# EAGLE design Adafruit HTU21DF Breakout (EAGLE 6.6.0)
COMPANY: ADAFRUIT INDUSTRIES; DRAWN: KTOWN; REV: A
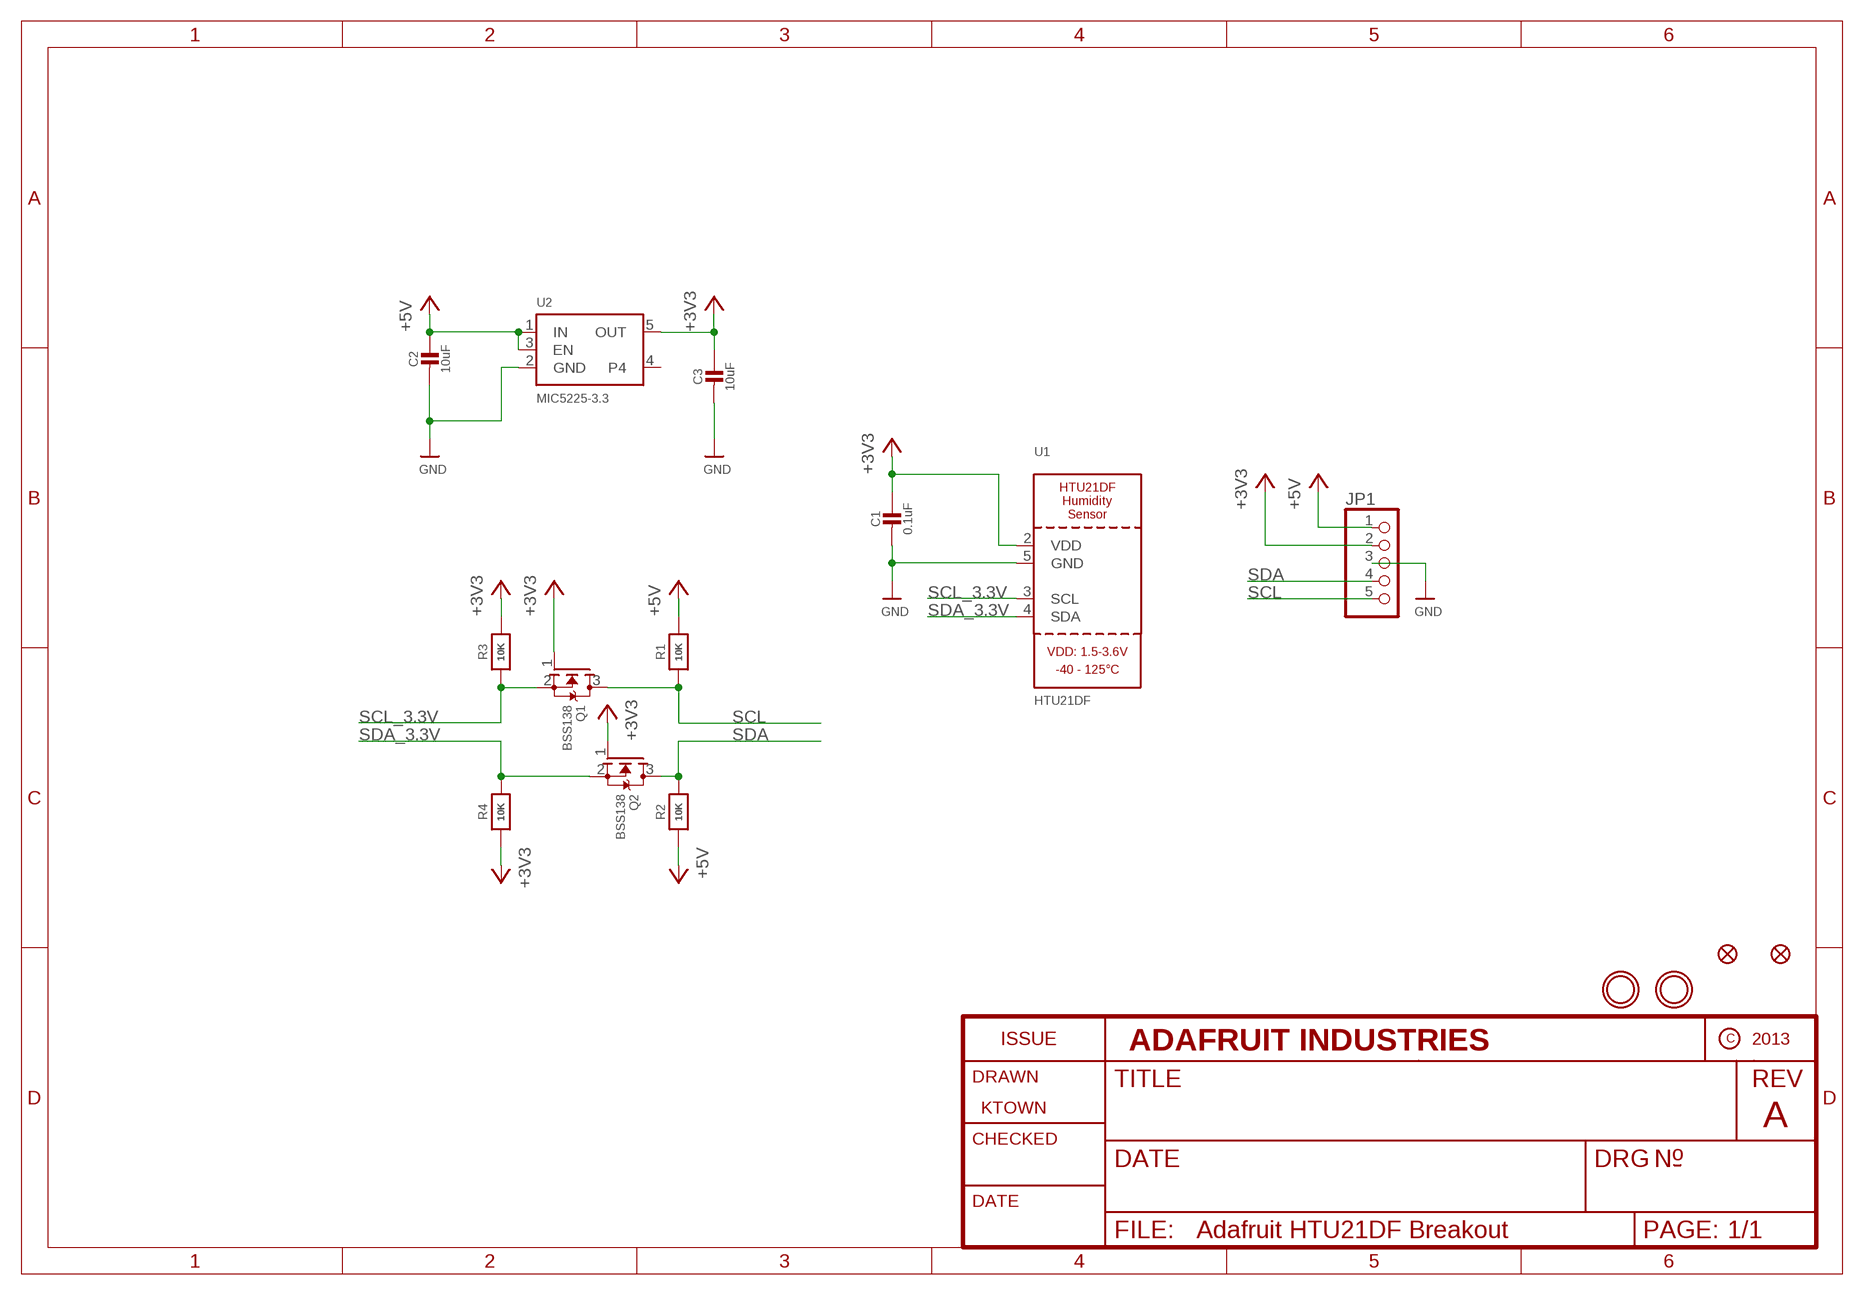
[diagram p0: schematic, sheet 1]

## Parts
C1  0.1uF  CAP_CERAMIC0805-NOOUTLINE  [0805-NO]
C2  10uF  CAP_CERAMIC0805-NOOUTLINE  [0805-NO]
C3  10uF  CAP_CERAMIC0805-NOOUTLINE  [0805-NO]
FID1  FIDUCIAL""  [FIDUCIAL_1MM]
FID2  FIDUCIAL""  [FIDUCIAL_1MM]
JP1  HEADER-1X570MIL  [1X05_ROUND_70]
Q1  BSS138  MOSFET-NWIDE  [SOT23-WIDE]
Q2  BSS138  MOSFET-NWIDE  [SOT23-WIDE]
R1  10K  RESISTOR0805_NOOUTLINE  [0805-NO]
R2  10K  RESISTOR0805_NOOUTLINE  [0805-NO]
R3  10K  RESISTOR0805_NOOUTLINE  [0805-NO]
R4  10K  RESISTOR0805_NOOUTLINE  [0805-NO]
U1  HTU21DF  [HTU21DF]
U2  MIC5225-3.3  VREG_SOT23-5  [SOT23-5]
U$3  MOUNTINGHOLE2.5  [MOUNTINGHOLE_2.5_PLATED]
U$4  MOUNTINGHOLE2.5  [MOUNTINGHOLE_2.5_PLATED]

## Nets
+3V3: C1.1 C3.1 JP1.2 Q1.1(G) Q2.1(G) R3.2 R4.1 U1.2(VDD) U2.5(OUT)
GND: C1.2 C2.2 C3.2 JP1.3 U1.5(GND) U2.2(GND)
SCL: JP1.5 Q1.3(D) R1.1
SCL_3.3V: Q1.2(S) R3.1 U1.3(SCL)
SDA: JP1.4 Q2.3(D) R2.2
SDA_3.3V: Q2.2(S) R4.2 U1.4(SDA)
VIN: C2.1 JP1.1 R1.2 R2.1 U2.1(IN) U2.3(EN) ; supply symbol labelled +5V
Unconnected: U2.4

## Library data of the parts
C1-C3 = microbuilder:CAP_CERAMIC: Ceramic Capacitors For new designs, use the packages preceded by an '_' character since they are more reliable: The following footprints should be used on most boards: _0402 - Standard footprint for regular board layouts _0603 - Standard footprint for regular board layouts _0805 - Standard footprint for regular board layouts _1206 - Standard footprint for regular board layouts For extremely tight-pitch boards where space is at a premium, the following 'micro-pitch' footprints can be used (smaller pads, no silkscreen outline, etc.): _0402MP - Micro-pitch footprint for very dense/compact boards _0603MP - Micro-pitch footprint for very dense/compact boards _0805MP - Micro-pitch footprint for very dense/compact boards _1206MP - Micro-pitch footprint for very dense/compact boards
FID1 FID2 = microbuilder:FIDUCIAL: Fiducial Alignment Points Various fiducial points for machine vision alignment.; BOM: EXCLUDE
JP1 = microbuilder:HEADER-1X5: PIN HEADER
Q1 Q2 = microbuilder:MOSFET-N: N-Channel Mosfet LEGEND VDS: Voltage Drain-Source ID: Drain Current RDS(ON): Drain-Source On-State Resistance VGS(TH): Gate-Source Threshold Voltage CISS: Drain-Source Input Capacitance SOT-23 Name VDS ID RDS(ON) VGS(TH) CISS Order Number 2N7002E 60V 260mA 2.5 Ohm 2.5V @ 250uA 26.7pF @ 25V 2N7002ET1GOSTR-ND BSH103 30V 850mA 400 mOhm 400mV @ 1mA 83pF @ 24V BSH103,235-ND BSS138 60V 320mA 1.6 Ohm 1.5V @ 250uA 50pF @ 10V Mouser: 771-BSS138PW115 DMN2075U-7 20V 4.2A 38 mOhm 1V @ 250 uA 594.3pF @ 10V DMN2075U-7DICT-ND * BSS138 good choice for I2C level-shifting POWERPAK 1212-8 Name VDS ID RDS(ON) VGS(TH) CISS Order Number Si7308DN 60V 6A 58 mOhm 3V @ 250uA 665pF @ 15V SI7308DN-T1-E3CT-ND
R1-R4 = microbuilder:RESISTOR: Resistors For new designs, use the packages preceded by an '_' character since they are more reliable: The following footprints should be used on most boards: _0402 - Standard footprint for regular board layouts _0603 - Standard footprint for regular board layouts _0805 - Standard footprint for regular board layouts _1206 - Standard footprint for regular board layouts For extremely tight-pitch boards where space is at a premium, the following 'micro-pitch' footprints can be used (smaller pads, no silkscreen outline, etc.): _0402MP - Micro-pitch footprint for very dense/compact boards _0603MP - Micro-pitch footprint for very dense/compact boards _0805MP - Micro-pitch footprint for very dense/compact boards _1206MP - Micro-pitch footprint for very dense/compact boards
U1 = microbuilder:HTU21DF: HTU21DF - Relative Humidity and Temperature Sensor
U2 = microbuilder:VREG_SOT23-5: SOT23-5 Fixed Voltage Regulators Part Current Out V Out V In V Dropout θJA (°C/W) TJ (°C) Digikey Part No. ADP121 150mA 3.3V 3.4-5.5V 0.09V @ 150mA -- -- ADP121-AUJZ33R7CT-ND ADP121 150mA 3.0V 3.1-5.5V 0.09V @ 150mA -- -- ADP121-AUJZ30R7CT-ND ADP122 300mA 3.3V 3.4-5.5V 0.085V @ 300mA -- -- ADP122AUJZ-3.3-R7CT-ND ADP1712 300mA 3.3V 3.5-5.5V 0.17V @ 300mA -- -- ADP1712AUJZ-3.3-R7TR-ND AP7311 (Low Cost) 150mA 3.3V 3.5-6V 0.15V @ 150mA -- -- AP7311-33WG-7DICT-ND LD39015M18R 150mA 1.8V 1.9V-5.5V 0.08V @ 100mA -- -- 497-6977-1-ND LP2985A-33DBVR 150mA 3.3V 3.3-16V 0.28V @ 150mA 206 150 296-18479-1-ND MCP1824T-3302E/OT 300mA 3.3V 3.5V-6V 0.2V @ 300mA -- -- MCP1824T-3302E/OTCT-ND MIC5205-2.5YM5 TR 150mA 2.5V 2.7-16V 0.165V @ 150mA -- -- 576-1257-2-ND MIC5205-3.0YM5 TR 150mA 3.0V 3.2V-16V 0.165V @ 150mA -- -- 576-1258-2-ND MIC5205-3.3YM5 TR 150mA 3.3V 3.5V-16V 0.165V @ 150mA -- -- 576-1259-2-ND TPS780330220 150mA 3.3V+2.2V 3.6-5.5V 250mV Max -- -- 296-23332-1-ND TDA3663/N1,135 100mA 3.3V 3.5-45V 0.18V @ 50mA -- -- 568-5343-1-ND Max operating temp can be calculated using θJA, TJ (max junction temperature), and power in watts. Set the "Maximum Ambient Temperature" until it reaches TJ ("Max Junction Temperature"), which is the absolute limit for safe use of the regulator: Heat Sink Temperature Calculator <http://www.daycounter.com/Calculators/Heat-Sink-Temperature-Calculator.phtml> For example, With 12V source into a 3.3V LP2985 and a 30mA load, we are dissipating (12V-3.3V) * 0.03A = 0.261W. With a θJA of 206 °C/W, a TJ of 150°C, and 261mW we can safely use the chip without a heat sink up to 75°C (=147.1°C Junction Temperature).
U$3 U$4 = microbuilder:MOUNTINGHOLE: Mounting Hole For #2 screws (0.086"/2.18mm width, 0.094"/2.4mm hole) use 2.5mm; BOM: EXCLUDE

## Board
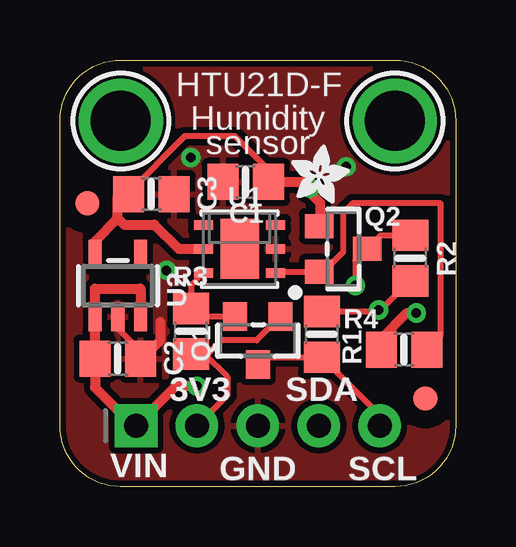
[diagram p1: board, top side]
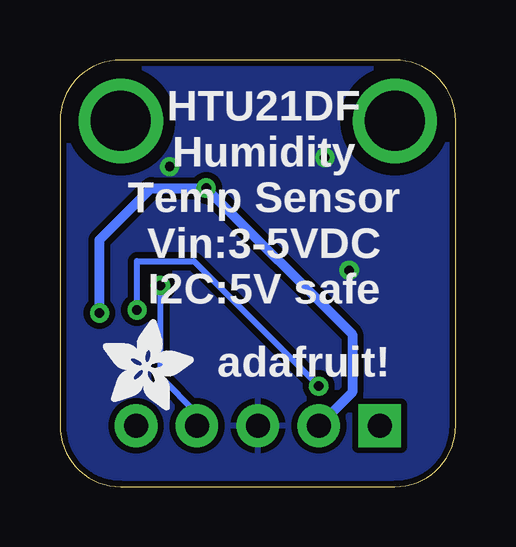
[diagram p2: board, bottom side, seen from below]

Size 16.51 x 17.78 mm. Coordinates in mm from the lower left corner, seen from the top.
Outline: 16.51,15.24 16.51,2.54 arc-90 13.97,0 2.54,0 arc-90 0,2.54 0,15.24 arc-90 2.54,17.78 13.97,17.78 arc-90 16.51,15.24
Copper layers (1*16): Top 0.035mm / dielectric 1.5mm / Bottom 0.035mm
Design rules "adafruit *": minimum track width 8mil, minimum drill 15.5mil, track to track 8mil, track to pad 8mil, pad to pad 8mil, via to via 8mil, smd to smd 8mil, copper to edge 10mil, drill to drill 8mil, minimum pad ring 10mil, minimum via ring 8mil, stop-mask expansion 2mil, vias tented up to drill 20mil, thermal gap 10mil

### Footprints (pad centres in the part's own frame; a part is rotated, then mirrored left to right if it is on the bottom)
0805-NO = smd 1.3 x 1.5: 1 -0.95,0; 2 0.95,0
FIDUCIAL_1MM = smd 1 x 1: 1 0,0
1X05_ROUND_70 = drill 1 pad 1.778 square: 1 -5.08,0 | drill 1 pad 1.778: 2 -2.54,0; 3 0,0; 4 2.54,0; 5 5.08,0
SOT23-WIDE = smd 1 x 1.2: 1 -0.95,-1; 2 0.95,-1; 3 0,1
HTU21DF = smd 0.8 x 0.4: 1 -1.5,1; 2 -1.5,0; 3 -1.5,-1; 4 1.5,-1; 5 1.5,0; 6 1.5,1 | smd 1.6 x 2.5: PAD 0,0
SOT23-5 = smd 0.55 x 1.2: 1 -0.95,-1.3; 2 0,-1.3; 3 0.95,-1.3; 4 0.95,1.3; 5 -0.95,1.3
MOUNTINGHOLE_2.5_PLATED = drill 2.5 pad 3.2: P$1 0,0

### Placement (x,y rotation side)
C1  7.75,12.7 180 top
C2  2.41,5.33 0 top
C3  3.81,12.19 0 top
FID1  1.14,11.81 0 top
FID2  15.24,3.68 0 top
JP1  8.26,2.54 0 top
Q1  8.26,6.1 180 top
Q2  11.81,9.91 270 top
R1  10.92,6.35 90 top
R2  14.61,9.53 90 top
R3  5.46,6.48 270 top
R4  14.35,5.71 0 top
U1  7.49,9.91 0 top
U2  2.41,8.38 0 top
U$1  [ADAFRUIT_3.5MM]  14.73,3.17 0 bottom
U$3  2.54,15.24 0 top
U$4  13.97,15.24 0 top
U$8  [ADAFRUIT_2.5MM]  9.65,11.81 0 top

### Tracks (layer width: path | path; a pad name or v marks a point on that pad's centre or on a via)
+3V3  (via drill 0.39)
  Top 0.254: Q1.1 8.21,6.1 6.73,6.1 6.16,5.53 R3.2 6.03,5.53 6.99,4.57 6.99,3.81 5.97,2.79 5.46,2.79 JP1.2 | C1.1 8.7,13.21 7.3,14.61 5.21,14.61 2.86,12.26 C3.1
  Top 0.406: U2.5 1.46,10.23 2.41,11.18 | 2.41,11.18 2.41,12.13 2.79,12.13 C3.1 | C1.1 9.98,12.7 | 9.98,12.7 10.85,11.83 10.85,10.9 Q2.1 | 2.41,11.18 2.67,10.92 3.94,10.92 4.95,9.91 U1.2 | R4.1 13.4,6.16 14.48,7.24 v14.86,7.24 | 9.98,12.7 10.16,12.7 v10.41,12.45
  Bottom 0.406: JP1.2 4.32,3.94 4.32,6.35 v10.41,12.45 12.7,12.45 14.86,10.29 v14.86,7.24
GND  (via drill 0.39)
  Top 0.254: U2.2 2.41,6.6 3.17,5.84 3.17,5.52 C2.2
  Top 0.406: C2.2 3.43,5.33 4.19,6.1 4.19,6.86
  other vias: 11.94,13.34 5.46,13.72 4.45,9.02
  pour Top (isolate 0.254): 0,0 0,17.78 16.51,17.78 16.51,0
  pour Bottom (isolate 0.254): 0,0 0,17.78 16.51,17.78 16.51,0
SCL
  Top 0.254: Q1.3 8.56,5.4 R1.1 13.34,2.99 JP1.5
SCL_3.3V
  Top 0.254: U1.3 5.46,8.37 R3.1 5.79,7.1 Q1.2
SDA  (via drill 0.39)
  Top 0.254: R2.2 13.38,10.47 Q2.3 12.32,9.41 v12.32,8.38
  Bottom 0.254: v12.32,8.38 12.32,4.57 10.79,3.05 JP1.4
SDA_3.3V
  Top 0.254: 10.51,8.91 10.56,8.96 | U1.4 9.04,8.96 10.56,8.96 | 10.56,8.96 Q2.2 10.99,8.96 11.81,9.78 11.81,11.43 12.19,11.81 15.88,11.81 15.88,6.28 R4.2
VIN  (via drill 0.39)
  Top 0.254: R1.2 13.23,7.3 v13.29,7.36 13.39,7.36 R2.1
  Top 0.406: U2.3 3.36,8.26 1.46,8.26 U2.1 C2.1 1.46,4.12 3.05,2.54 JP1.1 4.83,4.19 v5.71,4.19
  Bottom 0.254: v13.29,7.36 13.29,9.4 10.92,9.4 v5.71,4.19

### Text on the board
tPlace: HTU21D-F | Humidity | sensor | 3V3 | SDA | VIN | GND | SCL
bPlace: HTU21DF / Humidity / Temp Sensor / Vin:3-5VDC / I2C:5V safe | adafruit!